# EAGLE design tiny45-button-2-leds (EAGLE 9.3.0)
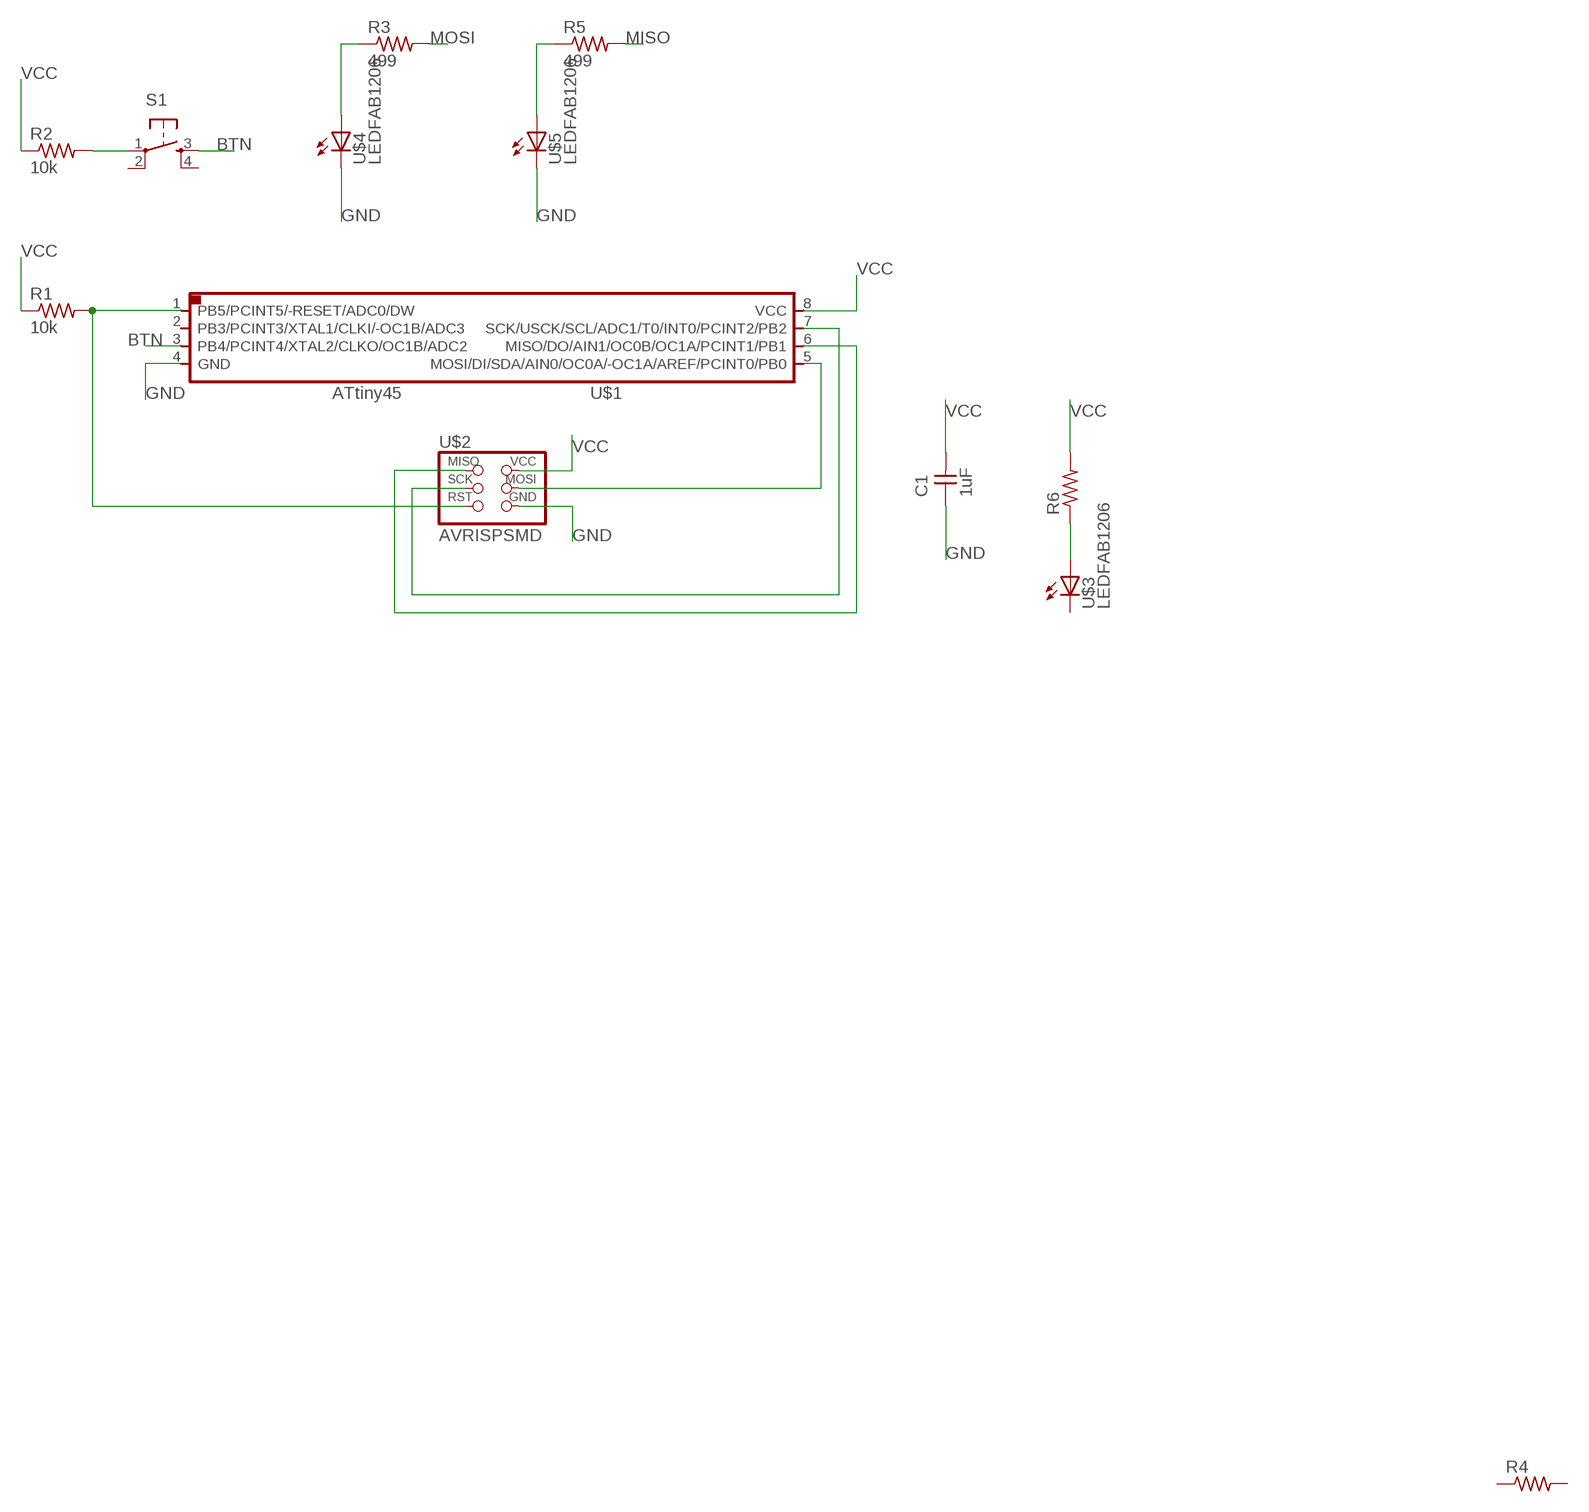
[diagram p0: schematic, sheet 1]

## Parts
C1  1uF  CAP-UNPOLARIZEDFAB  [C1206FAB]
R1  10k  RES-US1206FAB  [R1206FAB]
R2  10k  RES-US1206FAB  [R1206FAB]
R3  499  RES-US1206FAB  [R1206FAB]
R4  RES-US1206FAB  [R1206FAB]
R5  499  RES-US1206FAB  [R1206FAB]
R6  RES-US1206FAB  [R1206FAB]
S1  6MM_SWITCH6MM_SWITCH  [6MM_SWITCH]
U$1  ATTINY45SI  [SOIC8]
U$2  AVRISPSMD  [2X03SMD]
U$3  LEDFAB1206  [LED1206FAB]
U$4  LEDFAB1206  [LED1206FAB]
U$5  LEDFAB1206  [LED1206FAB]

## Nets
BTN: S1.3(S) U$1.3(PB4/PCINT4/XTAL2/CLKO/OC1B/ADC2)
GND: C1.1 R6.1 U$1.4(GND) U$2.6(GND) U$3.1(A) U$4.2(C) U$5.2(C)
MISO: R5.2
MOSI: R3.2
N$1: R5.1 U$5.1(A)
N$2: R2.2 S1.1(P)
N$4: R3.1 U$4.1(A)
N$5: U$1.5(MOSI/DI/SDA/AIN0/OC0A/-OC1A/AREF/PCINT0/PB0) U$2.4(MOSI)
N$6: U$1.7(SCK/USCK/SCL/ADC1/T0/INT0/PCINT2/PB2) U$2.3(SCK)
N$7: U$1.6(MISO/DO/AIN1/OC0B/OC1A/PCINT1/PB1) U$2.1(MISO)
N$8: R1.2 U$1.1(PB5/PCINT5/-RESET/ADC0/DW) U$2.5(RST)
VCC: C1.2 R1.1 R2.1 R6.2 U$1.8(VCC) U$2.2(VCC)
Unconnected: R4.1 R4.2 S1.2(P1) S1.4(S1) U$1.2(PB3/PCINT3/XTAL1/CLKI/-OC1B/ADC3) U$3.2(C)

## Library data of the parts
C1 = fab:CAP-UNPOLARIZED
R1-R6 = fab:RES-US: Resistor (US Symbol) Variants with postfix FAB are widened to allow the routing of internal traces
S1 = fab:6MM_SWITCH: OMRON SWITCH
U$1 = fab:ATTINY45
U$2 = fab:AVRISP
U$3-U$5 = fab:LED: LED

## Board
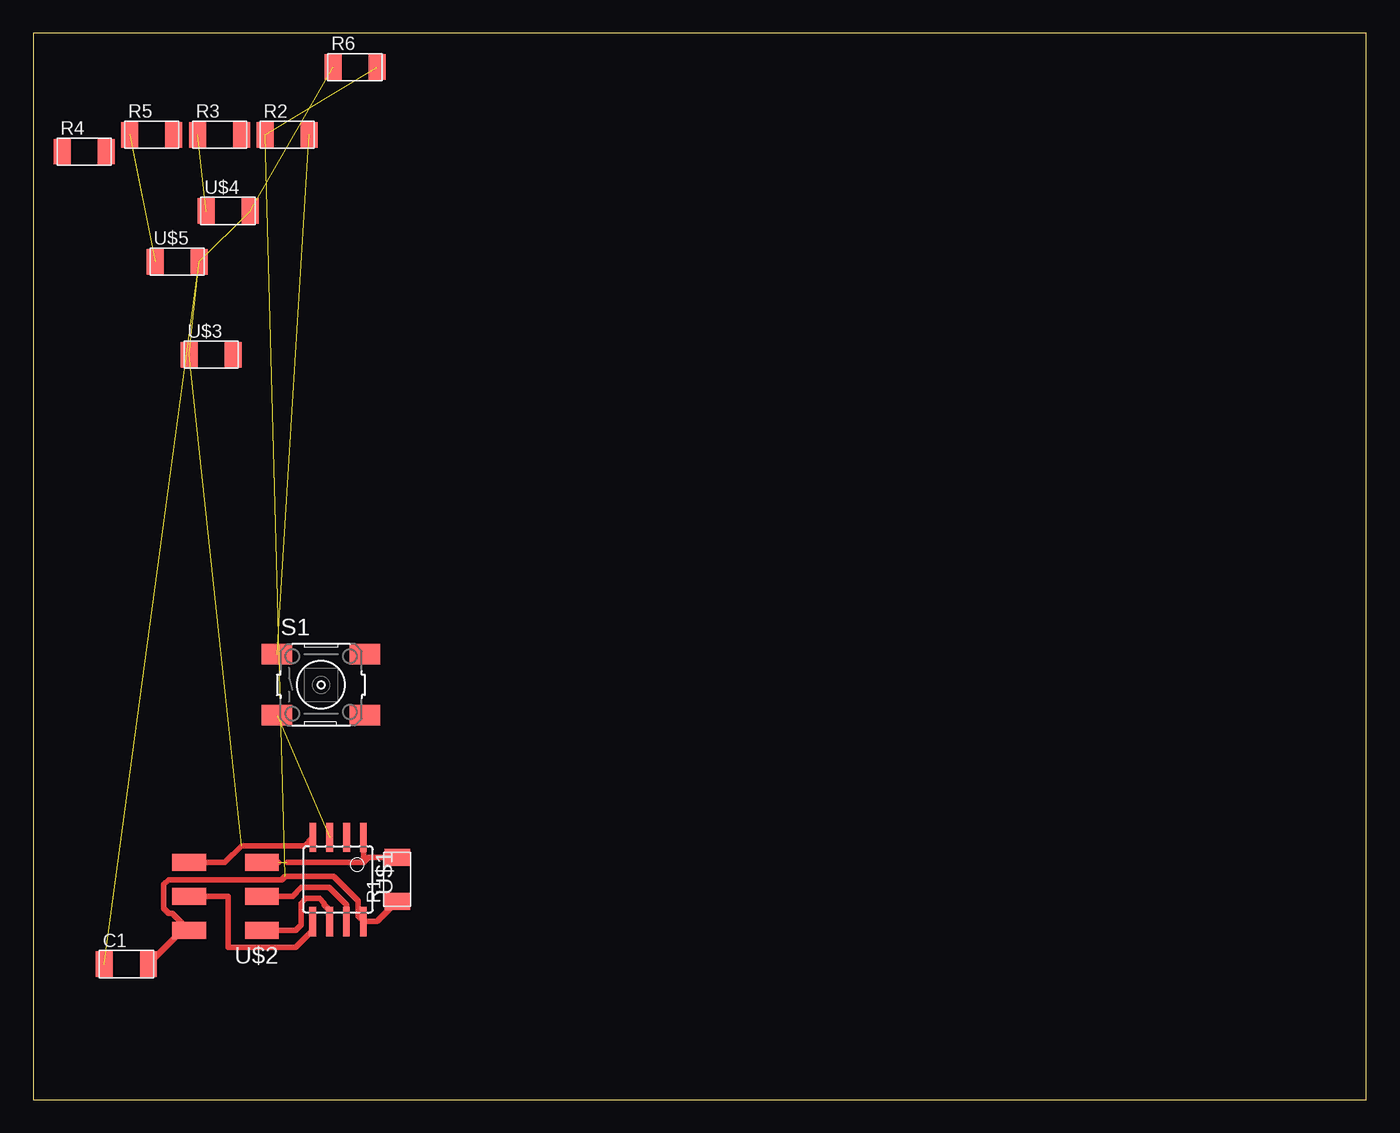
[diagram p1: board, top side]

Size 100 x 80 mm. Coordinates in mm from the lower left corner, seen from the top.
Outline: 0,0 100,0 100,80 0,80 0,0
Copper layers (1*16): Top 0.035mm / dielectric 1.5mm / Bottom 0.035mm
Design rules "fabmodule": minimum track width 10mil, minimum drill 0.4mm, track to track 0.42mm, track to pad 0.42mm, pad to pad 0.42mm, via to via 0.42mm, smd to smd 0.42mm, copper to edge 40mil, drill to drill 0.8mm, minimum pad ring 10mil, minimum via ring 8mil, stop-mask expansion 4mil, vias tented up to drill 0mil, thermal gap 10mil

### Footprints (pad centres in the part's own frame; a part is rotated, then mirrored left to right if it is on the bottom)
C1206FAB = smd 1.27 x 1.905: 1 -1.651,0; 2 1.651,0
R1206FAB = smd 1.27 x 1.905: 1 -1.651,0; 2 1.651,0
6MM_SWITCH = smd 2.286 x 1.524: 1 -3.302,2.286; 2 3.302,2.286; 3 -3.302,-2.286; 4 3.302,-2.286
SOIC8 = smd 0.5 x 2.2: 1 -1.905,-3.154; 2 -0.645,-3.154; 3 0.625,-3.154; 4 1.895,-3.154; 5 1.905,3.154; 6 0.635,3.154; 7 -0.635,3.154; 8 -1.905,3.154
2X03SMD = smd 2.54 x 1.27: 1 -2.54,2.54; 2 2.92,2.54; 3 -2.54,0; 4 2.92,0; 5 -2.54,-2.54; 6 2.92,-2.54
LED1206FAB = smd 1.27 x 1.905: 1 -1.651,0; 2 1.651,0

### Placement (x,y rotation side)
C1  6.99,10.16 0 top
R1  27.3,16.51 90 top
R2  19.05,72.39 0 top
R3  13.97,72.39 0 top
R4  3.81,71.12 0 top
R5  8.89,72.39 0 top
R6  24.13,77.47 0 top
S1  21.59,31.11 0 top
U$1  22.86,16.51 180 top
U$2  14.61,15.24 180 top
U$3  13.34,55.88 0 top
U$4  14.61,66.67 0 top
U$5  10.79,62.87 0 top

### Tracks (layer width: path | path; a pad name or v marks a point on that pad's centre or on a via)
BTN  (1 unrouted)
GND  (5 unrouted)
  Top 0.406: U$2.6 14.36,17.78 15.62,19.04 20.34,19.04 U$1.4
N$1  (1 unrouted)
N$2  (1 unrouted)
N$4  (1 unrouted)
N$5
  Top 0.406: U$2.4 14.61,15.24 14.61,11.43 19.68,11.43 20.95,12.7 U$1.5
N$6
  Top 0.406: U$2.3 19.44,15.24 20.11,15.91 22.19,15.91 23.5,14.61 U$1.7
N$7
  Top 0.406: 17.78,12.7 U$2.1 19.68,12.7 20.08,13.1 20.08,14.71 20.45,15.08 21.46,15.08 21.83,14.71 21.83,14.61 22.23,14.21 U$1.6
N$8  (1 unrouted)
  Top 0.406: U$2.5 18.41,17.78 | 19.05,17.78 24.77,17.78 | U$1.1 24.77,17.78 | 24.77,17.78 25.15,18.16 R1.2
VCC  (2 unrouted)
  Top 0.406: R1.1 25.8,13.36 U$1.8 24.37,13.75 24.37,14.9 22.54,16.73 18.88,16.73 18.65,16.5 10.16,16.5 9.79,16.13 9.79,14.35 10.16,13.98 10.4,13.98 U$2.2 11.18,12.7 C1.2